# EAGLE schematic Lamp Logic Board_30 BRAIN (EAGLE 9.5.1)

## Sheet 1 of 4
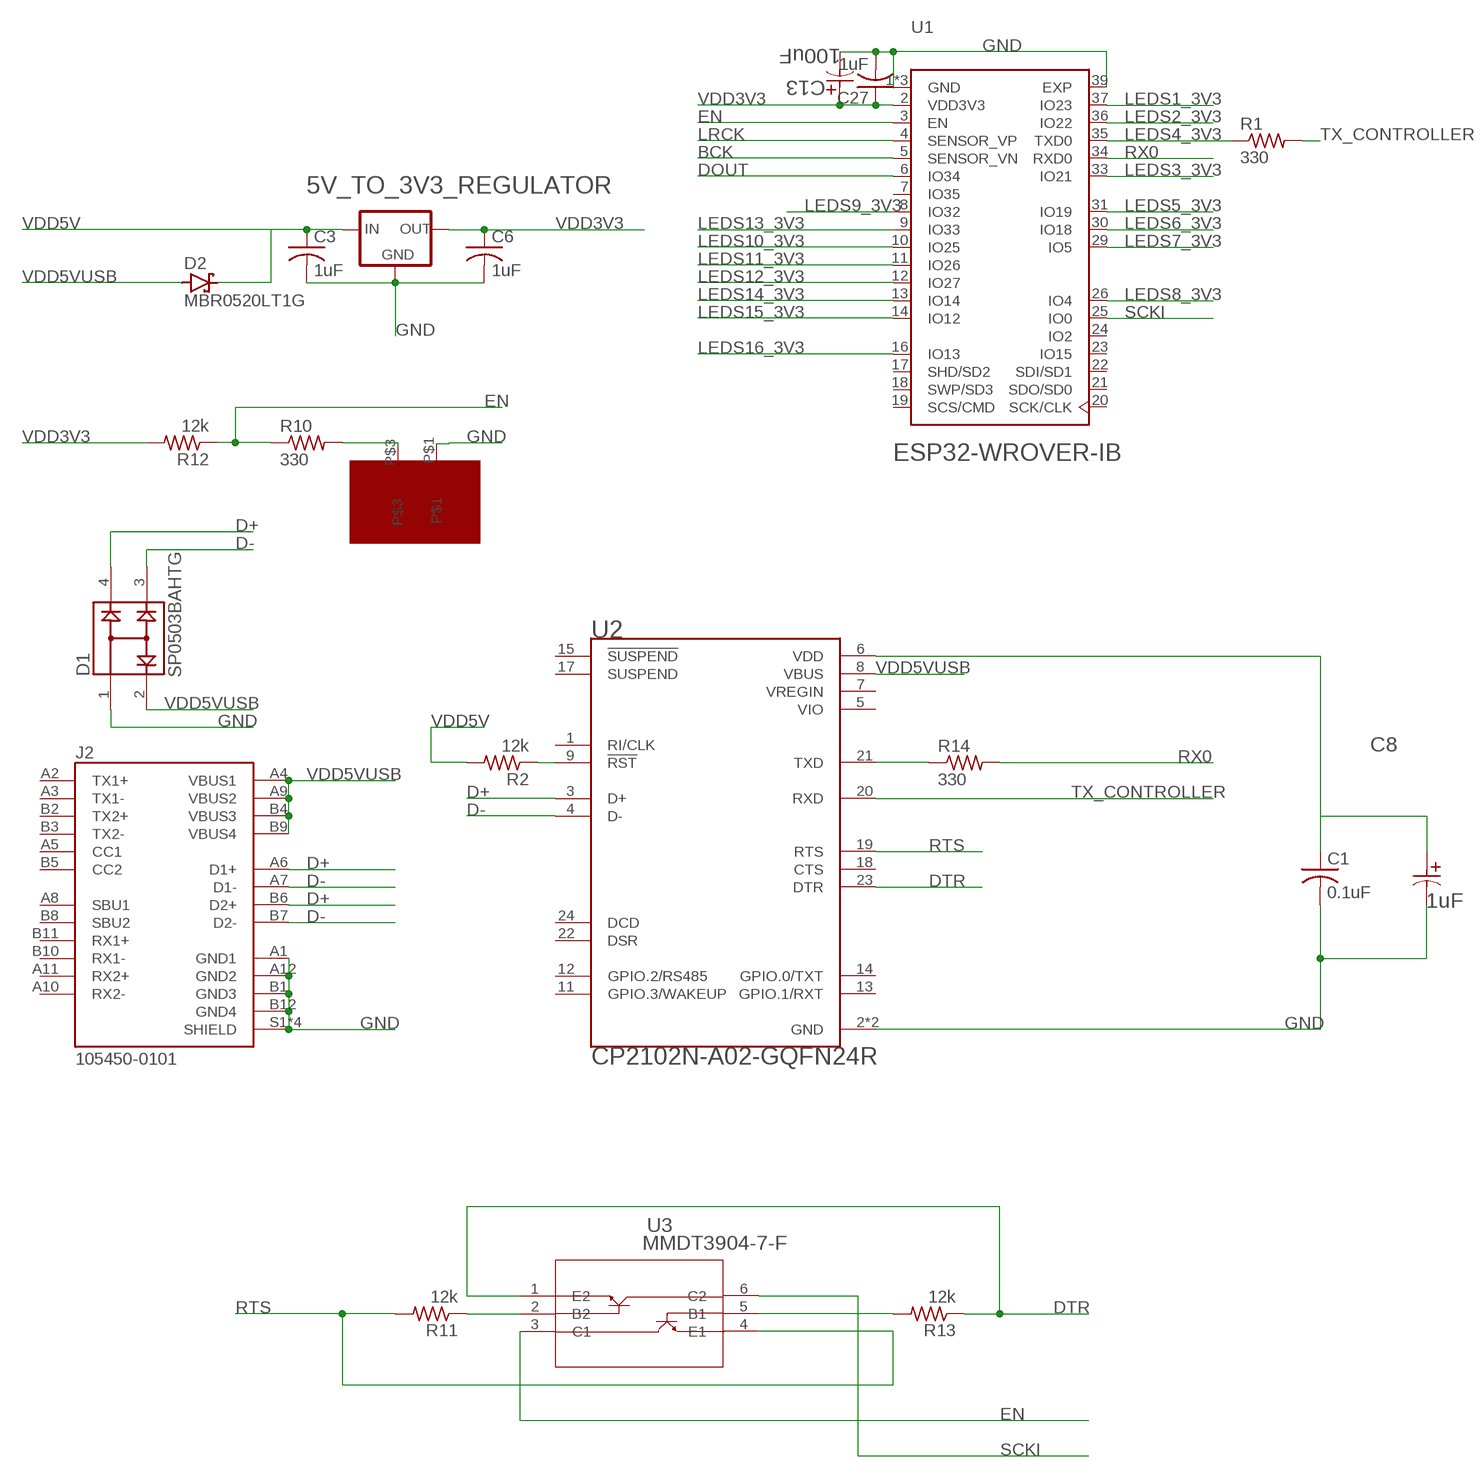
[diagram p0: schematic, sheet 1, part 1 of 2]
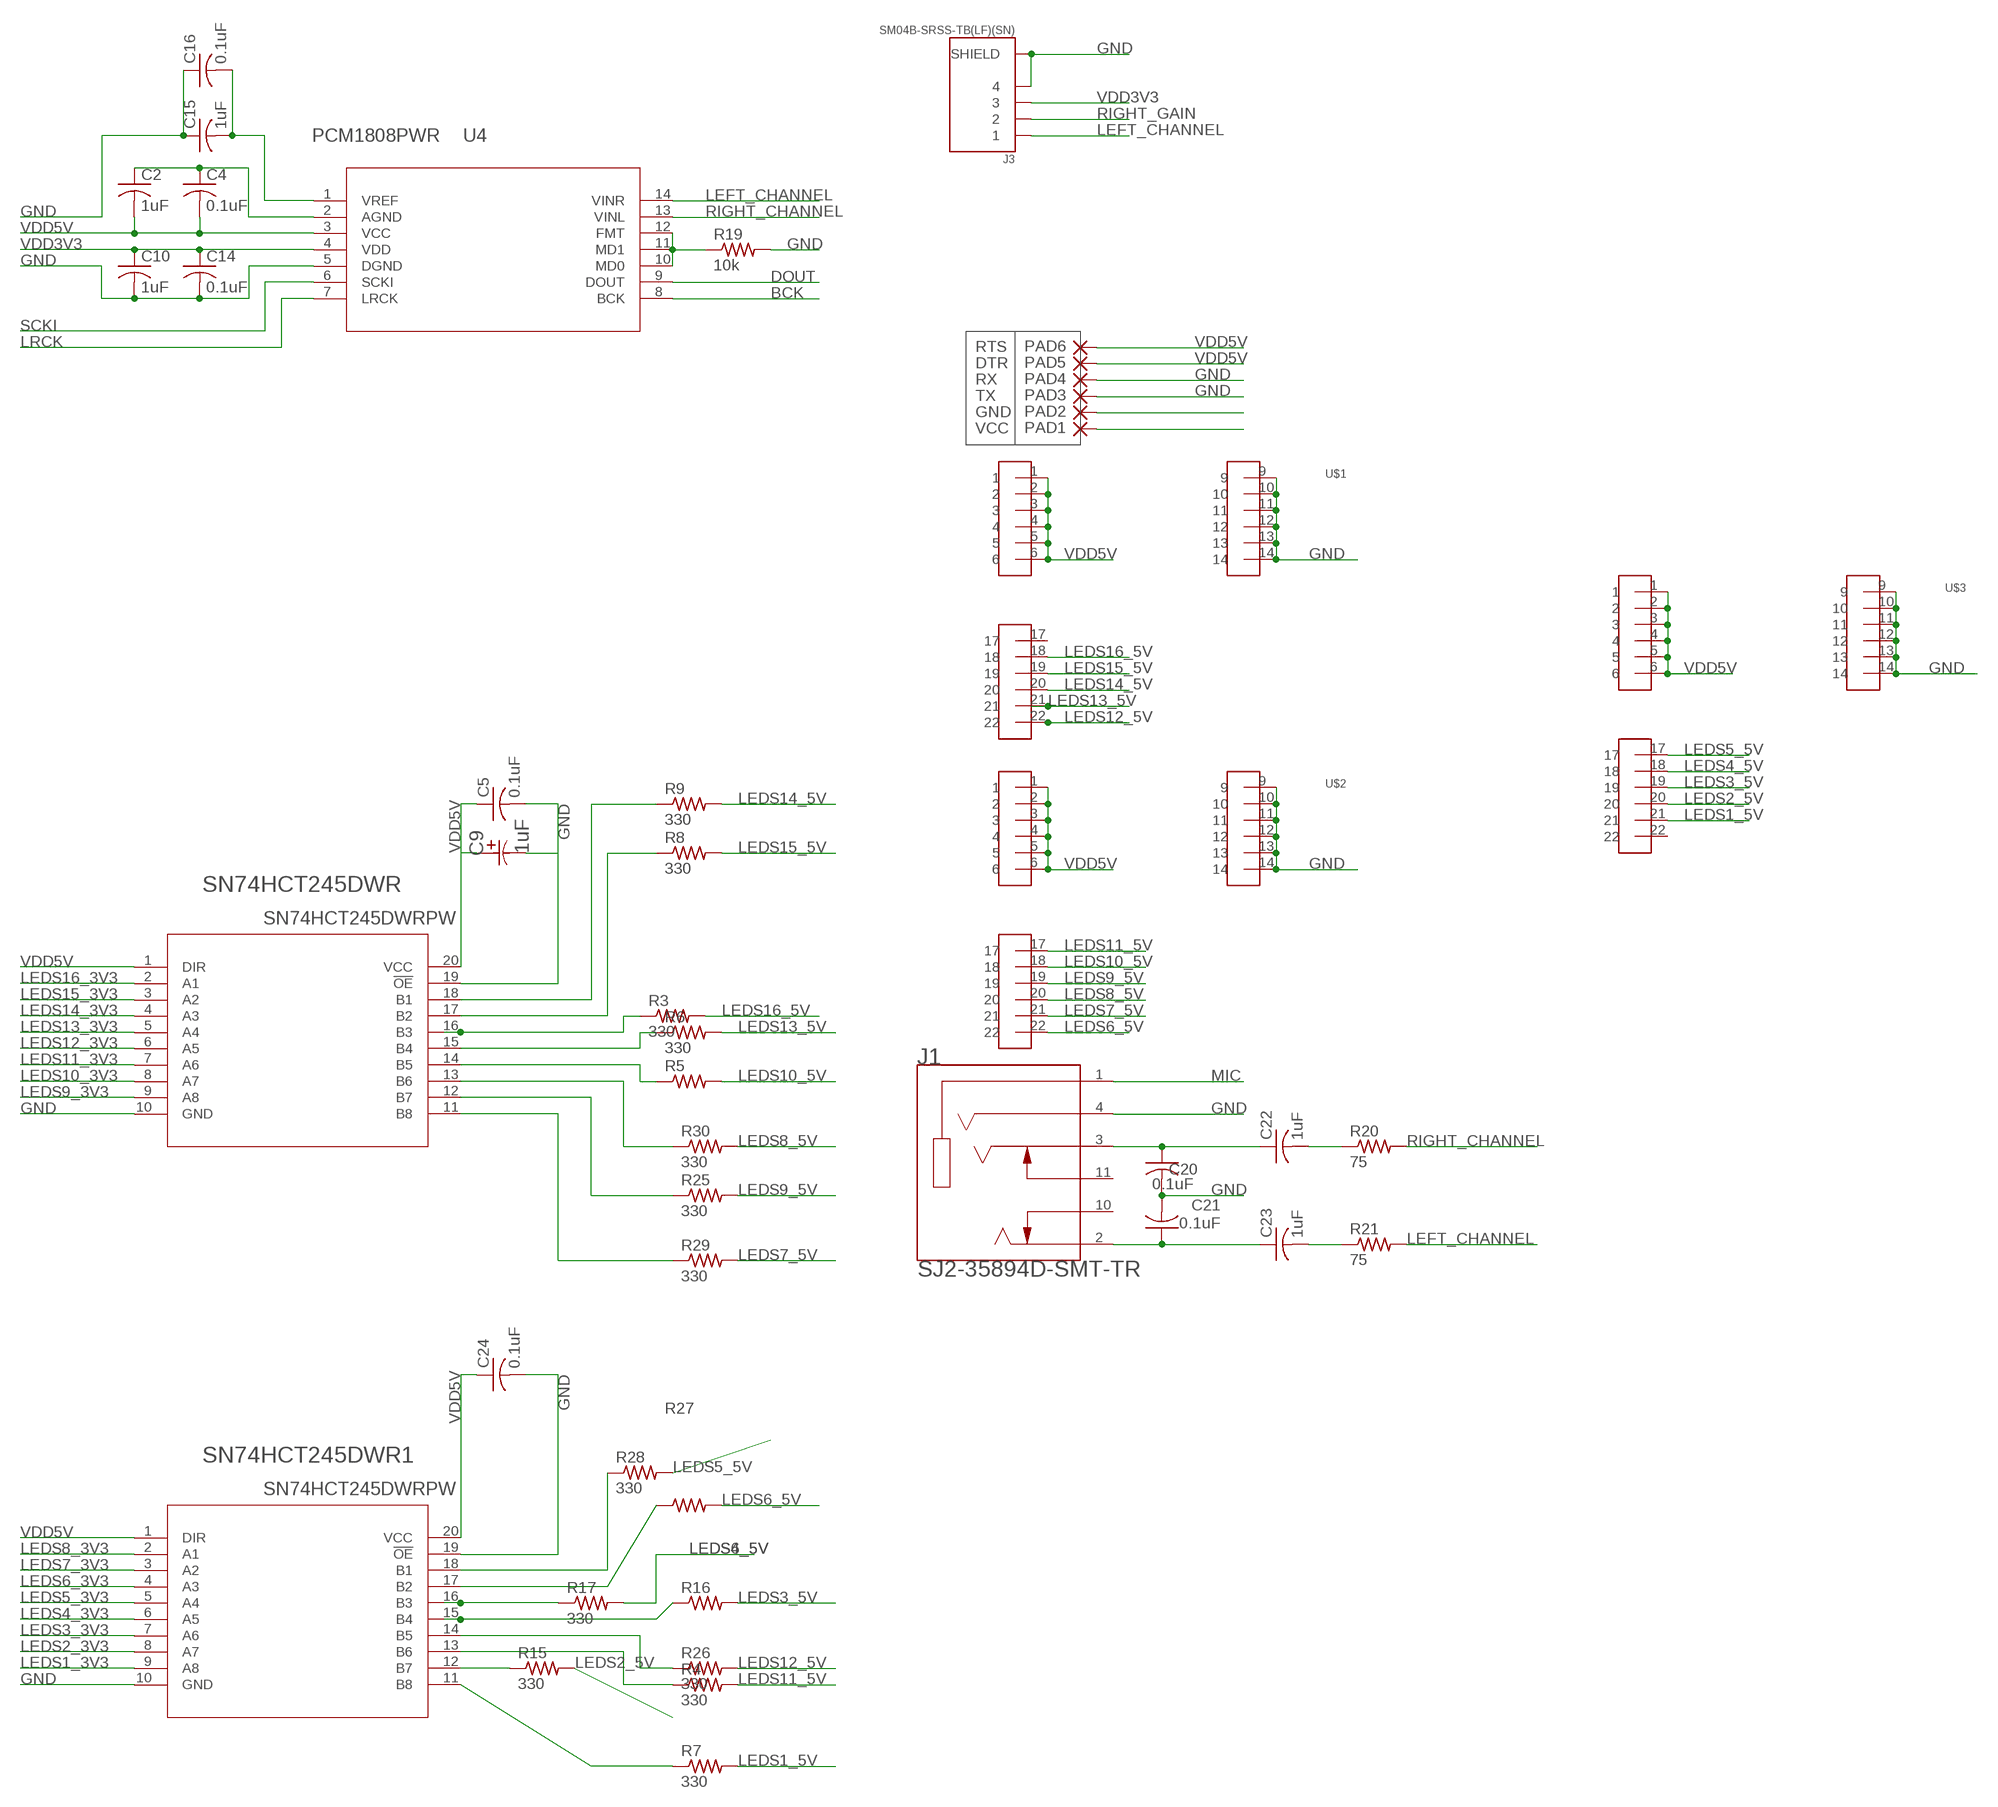
[diagram p1: schematic, sheet 1, part 2 of 2]

### Parts
5V_TO_3V3_REGULATOR  LM1117MP-1.8  [SOT223]
C1  0.1uF  C-USC0402  [C0402]
C2  1uF  C-USC0402  [C0402]
C3  1uF  C-USC0402  [C0402]
C4  0.1uF  C-USC0402  [C0402]
C5  0.1uF  C-USC0805  [C0805]
C6  1uF  C-USC0402  [C0402]
C8  1uF  EEEFC1V1R0R  [CAP_EEFC_B]
C9  1uF  EEEFC1V1R0R  [CAP_EEFC_B]
C10  1uF  C-USC0402  [C0402]
C13  100uF  EEEFC1V1R0R  [CAP_EEFC_B]
C14  0.1uF  C-USC0402  [C0402]
C15  1uF  C-USC0402  [C0402]
C16  0.1uF  C-USC0402  [C0402]
C20  0.1uF  C-USC0805  [C0805]
C21  0.1uF  C-USC0805  [C0805]
C22  1uF  C-USC0402  [C0402]
C23  1uF  C-USC0402  [C0402]
C24  0.1uF  C-USC0805  [C0805]
C27  1uF  C-USC0402  [C0402]
D1  SP0503BAHTG  [SOT143]
D2  MBR0520LT1G  [SOD-123]
J1  SJ2-35894D-SMT-TR  [CUI_SJ2-35894D-SMT-TR]
J2  105450-0101  [MOLEX_105450-0101]
J3  SM04B-SRSS-TB(LF)(SN)  [JST_SM04B-SRSS-TB(LF)(SN)]
PAD1  VCC  WIREPADSMD1,27-254  [SMD1,27-2,54]
PAD2  GND  WIREPADSMD1,27-254  [SMD1,27-2,54]
PAD3  TX  WIREPADSMD1,27-254  [SMD1,27-2,54]
PAD4  RX  WIREPADSMD1,27-254  [SMD1,27-2,54]
PAD5  DTR  WIREPADSMD1,27-254  [SMD1,27-2,54]
PAD6  RTS  WIREPADSMD1,27-254  [SMD1,27-2,54]
R1  330  RC0603JR-070RL  [RES_0603]
R2  12k  RC0603JR-070RL  [RES_0603]
R3  330  RC0603JR-070RL  [RES_0603]
R4  330  RC0603JR-070RL  [RES_0603]
R5  330  RC0603JR-070RL  [RES_0603]
R6  330  RC0603JR-070RL  [RES_0603]
R7  330  RC0603JR-070RL  [RES_0603]
R8  330  RC0603JR-070RL  [RES_0603]
R9  330  RC0603JR-070RL  [RES_0603]
R10  330  RC0603JR-070RL  [RES_0603]
R11  12k  RC0603JR-070RL  [RES_0603]
R12  12k  RC0603JR-070RL  [RES_0603]
R13  12k  RC0603JR-070RL  [RES_0603]
R14  330  RC0603JR-070RL  [RES_0603]
R15  330  RC0603JR-070RL  [RES_0603]
R16  330  RC0603JR-070RL  [RES_0603]
R17  330  RC0603JR-070RL  [RES_0603]
R19  10k  R-US_R1206  [R1206]
R20  75  R-US_R1206  [R1206]
R21  75  R-US_R1206  [R1206]
R25  330  RC0603JR-070RL  [RES_0603]
R26  330  RC0603JR-070RL  [RES_0603]
R27  330  RC0603JR-070RL  [RES_0603]
R28  330  RC0603JR-070RL  [RES_0603]
R29  330  RC0603JR-070RL  [RES_0603]
R30  330  RC0603JR-070RL  [RES_0603]
SN74HCT245DWR  SN74HCT245DWRPW  [PW]
SN74HCT245DWR1  SN74HCT245DWRPW  [PW]
U1  ESP32-WROVER-IB  ESP32-WROVER-I  [XCVR_ESP32-WROVER-I]
U2  CP2102N-A02-GQFN24R  [SILABS_CP2102N-A02-GQFN24R]
U3  MMDT3904-7-F  [SOT-363]
U4  PCM1808PWR  [PW14]
U$1  3X8PINHEAD  [3X8PINHEAD]
U$2  3X8PINHEAD  [3X8PINHEAD]
U$3  3X8PINHEAD  [3X8PINHEAD]
U$7  TL1014BF160QG  [TL1014BF160QG]

### Nets
BCK [LED Data]: U1.5(SENSOR_VN) U4.8(BCK)
D+ [LED Data]: D1.4 J2.A6(D1+) J2.B6(D2+) U2.3(D+)
D- [LED Data]: D1.3 J2.A7(D1-) J2.B7(D2-) U2.4(D-)
DOUT [LED Data]: U1.6(IO34) U4.9(DOUT)
DTR [LED Data]: R13.1 U2.23(DTR) U3.1(E2)
EN [LED Data]: R10.1 R12.1 U1.3(EN) U3.3(C1)
GND: 5V_TO_3V3_REGULATOR.1(GND) C1.2 C3.2 C5.2 C6.2 C8.2 C9.2 C10.2 C13.2 C14.2 C15.1 C16.1 C20.2 C21.2 C24.2 C27.2 D1.1 J1.4(RING2) J2.A1(GND1) J2.A12(GND2) J2.B1(GND3) J2.B12(GND4) J2.S1(SHIELD) J2.S2(SHIELD) J2.S3(SHIELD) J2.S4(SHIELD) J3.4 J3.S1(SHIELD) J3.S2(SHIELD) PAD3.1(P) PAD4.1(P) R19.2 SN74HCT245DWR1.10(GND) SN74HCT245DWR1.19(!OE) SN74HCT245DWR.10(GND) SN74HCT245DWR.19(!OE) U1.1(GND) U1.15(GND) U1.38(GND) U1.39(EXP) U2.2(GND) U2.25(GND) U4.5(DGND) U$1.9 U$1.10 U$1.11 U$1.12 U$1.13 U$1.14 U$2.9 U$2.10 U$2.11 U$2.12 U$2.13 U$2.14 U$3.9 U$3.10 U$3.11 U$3.12 U$3.13 U$3.14 U$7.P$1
LEDS1_3V3 [LED Data]: SN74HCT245DWR1.9(A8) U1.37(IO23)
LEDS1_5V [LED Data]: R7.2 U$3.21
LEDS2_3V3 [LED Data]: SN74HCT245DWR1.8(A7) U1.36(IO22)
LEDS2_5V [LED Data]: R15.2 U$3.20
LEDS3_3V3 [LED Data]: SN74HCT245DWR1.7(A6) U1.33(IO21)
LEDS3_5V [LED Data]: R16.2 U$3.19
LEDS4_3V3 [LED Data]: R1.1 SN74HCT245DWR1.6(A5) U1.35(TXD0)
LEDS4_5V [LED Data]: R17.2 U$3.18
LEDS5_3V3 [LED Data]: SN74HCT245DWR1.5(A4) U1.31(IO19)
LEDS5_5V [LED Data]: R28.2 U$3.17
LEDS6_3V3 [LED Data]: SN74HCT245DWR1.4(A3) U1.30(IO18)
LEDS6_5V [LED Data]: R27.2 U$2.22
LEDS7_3V3 [LED Data]: SN74HCT245DWR1.3(A2) U1.29(IO5)
LEDS7_5V [LED Data]: R29.2 U$2.21
LEDS8_3V3 [LED Data]: SN74HCT245DWR1.2(A1) U1.26(IO4)
LEDS8_5V [LED Data]: R30.2 U$2.20
LEDS9_3V3 [LED Data]: SN74HCT245DWR.9(A8) U1.8(IO32)
LEDS9_5V [LED Data]: R25.2 U$2.19
LEDS10_3V3 [LED Data]: SN74HCT245DWR.8(A7) U1.10(IO25)
LEDS10_5V [LED Data]: R5.2 U$2.18
LEDS11_3V3 [LED Data]: SN74HCT245DWR.7(A6) U1.11(IO26)
LEDS11_5V [LED Data]: R4.2 U$2.17
LEDS12_3V3 [LED Data]: SN74HCT245DWR.6(A5) U1.12(IO27)
LEDS12_5V [LED Data]: R26.2 U$1.22
LEDS13_3V3 [LED Data]: SN74HCT245DWR.5(A4) U1.9(IO33)
LEDS13_5V [LED Data]: R6.2 U$1.21
LEDS14_3V3 [LED Data]: SN74HCT245DWR.4(A3) U1.13(IO14)
LEDS14_5V [LED Data]: R9.2 U$1.20
LEDS15_3V3 [LED Data]: SN74HCT245DWR.3(A2) U1.14(IO12)
LEDS15_5V [LED Data]: R8.2 U$1.19
LEDS16_3V3 [LED Data]: SN74HCT245DWR.2(A1) U1.16(IO13)
LEDS16_5V [LED Data]: R3.2 U$1.18
LEFT_CHANNEL [LED Data]: J3.1 R21.2 U4.14(VINR)
LRCK [LED Data]: U1.4(SENSOR_VP) U4.7(LRCK)
MIC [LED Data]: J1.1(SLEEVE)
N$1 [LED Data]: R9.1 SN74HCT245DWR.18(B1)
N$2 [LED Data]: C2.1 C4.1 U4.2(AGND)
N$3 [LED Data]: C20.1 C22.1 J1.3(RING1)
N$4 [LED Data]: C21.1 C23.1 J1.2(TIP)
N$5 [LED Data]: C1.1 C8.1 U2.6(VDD)
N$6 [LED Data]: R7.1 SN74HCT245DWR1.11(B8)
N$7 [LED Data]: R11.1 U3.2(B2)
N$8 [LED Data]: R13.2 U3.5(B1)
N$9 [LED Data]: R10.2 U$7.P$3
N$10 [LED Data]: R28.1 SN74HCT245DWR1.18(B1)
N$11 [LED Data]: R6.1 SN74HCT245DWR.15(B4)
N$12 [LED Data]: R5.1 SN74HCT245DWR.14(B5)
N$13 [LED Data]: R27.1 SN74HCT245DWR1.17(B2)
N$14 [LED Data]: R8.1 SN74HCT245DWR.17(B2)
N$15 [LED Data]: R26.1 SN74HCT245DWR1.14(B5)
N$16 [LED Data]: C22.2 R20.1
N$17 [LED Data]: C15.2 C16.2 U4.1(VREF)
N$18 [LED Data]: R14.1 U2.21(TXD)
N$19 [LED Data]: R3.1 SN74HCT245DWR.16(B3)
N$20 [LED Data]: R15.1 SN74HCT245DWR1.12(B7)
N$21 [LED Data]: R17.1 SN74HCT245DWR1.16(B3)
N$22 [LED Data]: R16.1 SN74HCT245DWR1.15(B4)
N$24 [LED Data]: C23.2 R21.1
N$26 [LED Data]: R29.1 SN74HCT245DWR.11(B8)
N$27 [LED Data]: R4.1 SN74HCT245DWR1.13(B6)
N$28 [LED Data]: R2.1 U2.9(!RST)
N$30 [LED Data]: R19.1 U4.10(MD0) U4.11(MD1) U4.12(FMT)
N$32: PAD2.1(P)
N$33: PAD1.1(P)
N$34 [LED Data]: R30.1 SN74HCT245DWR.13(B6)
N$35 [LED Data]: R25.1 SN74HCT245DWR.12(B7)
RIGHT_CHANNEL [LED Data]: R20.2 U4.13(VINL)
RIGHT_GAIN [LED Data]: J3.2
RTS [LED Data]: R11.2 U2.19(RTS) U3.4(E1)
RX0 [LED Data]: R14.2 U1.34(RXD0)
SCKI [LED Data]: U1.25(IO0) U3.6(C2) U4.6(SCKI)
TX_CONTROLLER [LED Data]: R1.2 U2.20(RXD)
VDD3V3: 5V_TO_3V3_REGULATOR.2(OUT) 5V_TO_3V3_REGULATOR.4(OUT) C6.1 C10.1 C13.1 C14.1 C27.1 J3.3 R12.2 U1.2(VDD3V3) U4.4(VDD)
VDD5V: 5V_TO_3V3_REGULATOR.3(IN) C2.2 C3.1 C4.2 C5.1 C9.1 C24.1 D2.C PAD5.1(P) PAD6.1(P) R2.2 SN74HCT245DWR1.1(DIR) SN74HCT245DWR1.20(VCC) SN74HCT245DWR.1(DIR) SN74HCT245DWR.20(VCC) U4.3(VCC) U$1.1 U$1.2 U$1.3 U$1.4 U$1.5 U$1.6 U$2.1 U$2.2 U$2.3 U$2.4 U$2.5 U$2.6 U$3.1 U$3.2 U$3.3 U$3.4 U$3.5 U$3.6
VDD5VUSB: D1.2 D2.A J2.A4(VBUS1) J2.A9(VBUS2) J2.B4(VBUS3) J2.B9(VBUS4) U2.8(VBUS)
Unconnected: J1.10(TIP_SWITCH) J1.11(RING1_SWITCH) J2.A2(TX1+) J2.A3(TX1-) J2.A5(CC1) J2.A8(SBU1) J2.A10(RX2-) J2.A11(RX2+) J2.B2(TX2+) J2.B3(TX2-) J2.B5(CC2) J2.B8(SBU2) J2.B10(RX1-) J2.B11(RX1+) U1.7(IO35) U1.17(SHD/SD2) U1.18(SWP/SD3) U1.19(SCS/CMD) U1.20(SCK/CLK) U1.21(SDO/SD0) U1.22(SDI/SD1) U1.23(IO15) U1.24(IO2) U2.1(RI/CLK) U2.5(VIO) U2.11(GPIO.3/WAKEUP) U2.12(GPIO.2/RS485) U2.13(GPIO.1/RXT) U2.14(GPIO.0/TXT) U2.15(!SUSPEND) U2.17(SUSPEND) U2.18(CTS) U2.22(DSR) U2.24(DCD) U$1.17 U$3.22

## Sheet 2 of 4

## Sheet 3 of 4

## Sheet 4 of 4

## Power pins joined to a net without a drawn wire
VREGIN: U2.7(VREGIN)

## Library data of the parts
5V_TO_3V3_REGULATOR = lm1117:LM1117?-*: 800mA Low-Dropout Linear Regulator Source: http://ww1.microchip.com/downloads/en/DeviceDoc/39760d.pdf; MF: Texas Instruments; MPN: LM1117MP-1.8; OC_FARNELL: 1469053; OC_NEWARK: 41K3467
C1-C6 C10 C14-C16 C20-C24 C27 = resistor:C-US: CAPACITOR, American symbol
C8 C9 C13 = EEE-FC1V1R0R:EEEFC1V1R0R; MANUFACTURER_PART_NUMBER: EEEFC1V1R0R; VENDOR: Panasonic
D1 = SP0503BAHTG:SP0503BAHTG: TVS DIODE 5.5VWM 8.5VC SOT143; DESCRIPTION: SP050xBA Series 8 V 30 pF Uni-Directional SMT TVS Avalanche Diode Array SOT-143; DIGI-KEY_PART_NUMBER: F2715CT-ND; DIGI-KEY_PURCHASE_URL: https://www.digikey.com/product-detail/en/littelfuse-inc/SP0503BAHTG/F2715CT-ND/1154322?utm_source=snapeda&utm_medium=aggregator&utm_campaign=symbol; MF: Littelfuse Inc.; MP: SP0503BAHTG; PACKAGE: SOT-143 Littelfuse
D2 = Diodes:MBR0520LT1G: DIODE SCHOTTKY 20V 500MA SOD123 Manufacturer's datasheet <https://www.onsemi.com/pub/Collateral/MBR0520LT1-D.PDF>; CREATED_BY: PCBLayout.com; DIGIKEY_PART_NUMBER: MBR0520LT1GOSTR-ND; MANUFACTURER: ON Semiconductor; MPN: MBR0520LT1G; PACKAGE: SOD-123
J1 = SJ2-35894D-SMT-TR:SJ2-35894D-SMT-TR: 4 conductors, 3.5mm, SMT Audio Jack w/ 2 Switch; CUI_PURCHASE_URL: https://www.cui.com/product/interconnect/connectors/audio-connectors/jacks/sj2-3589x-smt-series?utm_source=snapeda.com&utm_medium=referral&utm_campaign=snapedaBOM; DESCRIPTION: 3.5 mm, Stereo, Right Angle, Surface Mount _SMT_, Audio Jack Connector; DIGI-KEY_PART_NUMBER: CP-SJ2-35894D-SMT-CT-ND; DIGI-KEY_PURCHASE_URL: https://www.digikey.com/product-detail/en/cui-inc/SJ2-35894D-SMT-TR/CP-SJ2-35894D-SMT-CT-ND/6619623?utm_source=snapeda&utm_medium=aggregator&utm_campaign=symbol; MF: CUI Inc.; MP: SJ2-35894D-SMT-TR; PACKAGE: None
J2 = 105450-0101:105450-0101: USB Shielded I/O Receptacle; Type C; Right Angle; Surface Mount; Gold over Nickel; DESCRIPTION: USB Shielded I/O Receptacle; Type C; Right Angle; Surface Mount; Gold over Nickel; DIGI-KEY_PART_NUMBER: WM12856CT-ND; DIGI-KEY_PURCHASE_URL: https://www.digikey.com/product-detail/en/molex/1054500101/WM12856CT-ND/5843891?utm_source=snapeda&utm_medium=aggregator&utm_campaign=symbol; MF: Molex; MP: 1054500101; PACKAGE: None
J3 = SM04B-SRSS-TB_LF__SN_:SM04B-SRSS-TB(LF)(SN): SH Series 1.0 mm Pitch 2 Position Single Row Side Entry Shrouded Header; AVAILABILITY: Unavailable; DESCRIPTION: SH Series 1.0 mm Pitch 2 Position Single Row Side Entry Shrouded Header; MF: JST Sales; MP: SM04B-SRSS-TB_LF__SN_; PACKAGE: None; PRICE: None
PAD1-PAD6 = wirepad:WIREPAD: Wire PAD connect wire on PCB
R1-R17 R25-R30 = Resistor_Capacitor:RC0603JR-070RL: RES SMD 0 OHM JUMPER 1/10W 0603 Manufacturer's datasheet <http://www.yageo.com/documents/recent/PYu-RC_Group_51_RoHS_L_10.pdf>; CREATED_BY: PCBLayout.com; DIGIKEY_PART_NUMBER: 311-0.0GRTR-ND; MANUFACTURER: Yageo; MPN: RC0603JR-070RL; PACKAGE: SMD 0603
R19-R21 = resistor:R-US_: RESISTOR, American symbol
SN74HCT245DWR SN74HCT245DWR1 = SN74HCT245DWR :SN74HCT245DWR
U1 = ESP32-WROVER-I:ESP32-WROVER-I: Module: combo; GPIO, I2C x2, I2S x2, SDIO, SPI x3, UART x3; U.FL; AVAILABILITY: Unavailable; DESCRIPTION: Module: combo; GPIO, I2C x2, I2S x2, SDIO, SPI x3, UART x3; U.FL; MF: Espressif Systems; MP: ESP32-WROVER-I; PACKAGE: Module Espressif Systems; PRICE: None
U2 = CP2102N-A02-GQFN20R:CP2102N-A02-GQFN24R: IC USB TO UART BRIDGE QFN20
U3 = MMDT3904:MMDT3904-7-F; MANUFACTURER_PART_NUMBER: MMDT39047F; VENDOR: Diodes Inc
U4 = PCM1808PWR:PCM1808PWR; MANUFACTURER_PART_NUMBER: PCM1808PWR; VENDOR: Texas Instruments
U$1-U$3 = 3X8PINHEAD:3X8PINHEAD
U$7 = TL1014BF160QG:TL1014BF160QG

## Net classes
1 LED Data: width 0.305 mm, drill 0.25 mm